# EAGLE design powerboard (EAGLE 7.7.0)
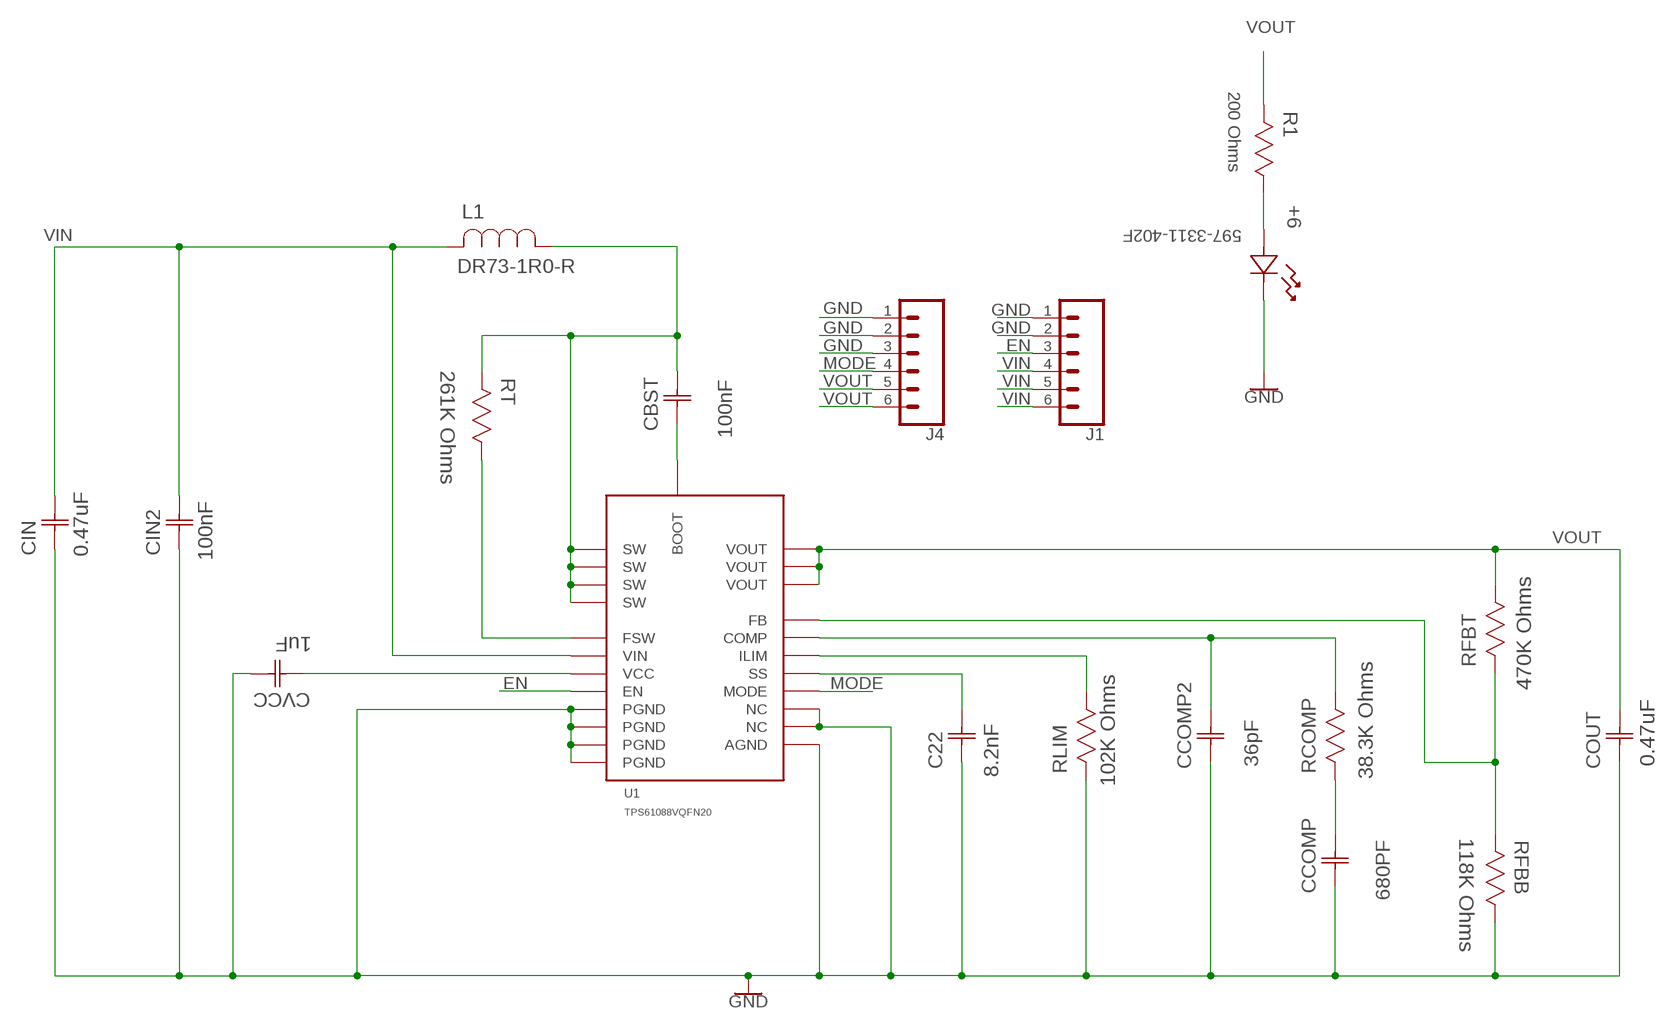
[diagram p0: schematic, sheet 1]

## Parts
+6  597-3311-402F  [LED_597-3311-402F]
C22  8.2nF  C0402C822K5RACTU  [CAPC1005X60N]
CBST  100nF  08053C104KAT2A  [CAPC2013X94N]
CCOMP  680PF  0603YC681JAT2A  [CAPC1608X90N]
CCOMP2  36pF  C0402C360J5GACTU  [CAPC1005X60N]
CIN  0.47uF  C1206F474K5RACAUTO  [CAPC3216X180N]
CIN2  100nF  GRM155R71C104KA88D  [CAPC1005X60N]
COUT  0.47uF  C1206F474K5RACAUTO  [CAPC3216X180N]
CVCC  1uF  GRM188R60J105KA01D  [CAPC1608X85N]
J1  CONN_06LONGPADS  [1X06_LONGPADS]
J4  CONN_06LONGPADS  [1X06_LONGPADS]
L1  DR73-1R0-R  [INDM7676X355N]
R1  200 Ohms  CRCW1206200RJNEA  [RESC3216X71N]
RCOMP  38.3K Ohms  CRCW040238K3FKED  [RESC1005X40N]
RFBB  118K Ohms  CRCW0402118KFKED  [RESC1005X40N]
RFBT  470K Ohms  RC0603FR-07470KL  [RESC1608X60N]
RLIM  102K Ohms  CRCW0402102KFKED  [RESC1005X40N]
RT  261K Ohms  CRCW0402261KFKED  [RESC1005X40N]
U1  TPS61088VQFN20  [VQFN20]

## Nets
BOOT: CBST.1(C1) U1.P$8(BOOT)
COMP: CCOMP2.2(C2) RCOMP.1 U1.P$18(COMP)
EN: J1.3 U1.P$2(EN)
FB: RFBB.2 RFBT.2(R2) U1.P$17(FB)
FSW: RT.1 U1.P$3(FSW)
GND: +6.1 C22.1(C1) CCOMP2.1(C1) CCOMP.1(C1) CIN2.1(C1) CIN.1(C1) COUT.1(C1) CVCC.2(C2) J1.1(>NAME) J1.2 J4.1(>NAME) J4.2 J4.3 RFBB.1 RLIM.2 U1.P$11(NC) U1.P$12(NC) U1.P$20(AGND) U1.P$21(PGND) U1.P$22(PGND) U1.P$23(PGND) U1.P$24(PGND)
ILIM: RLIM.1 U1.P$19(ILIM)
LED_ANODE: +6.2 R1.1
MODE: J4.4 U1.P$13(MODE)
N$1: CCOMP.2(C2) RCOMP.2
SS: C22.2(C2) U1.P$10(SS)
SW: CBST.2(C2) L1.1 RT.2 U1.P$4(SW) U1.P$5(SW) U1.P$6(SW) U1.P$7(SW)
VCC: CVCC.1(C1) U1.P$1(VCC)
VIN: CIN2.2(C2) CIN.2(C2) J1.4 J1.5 J1.6 L1.2 U1.P$9(VIN)
VOUT: COUT.2(C2) J4.5 J4.6 R1.2 RFBT.1(R1) U1.P$14(VOUT) U1.P$15(VOUT) U1.P$16(VOUT)

## Library data of the parts
+6 = Dialight_By_element14_Batch_1:597-3311-402F: LED 1206 Green SMT; COLOR: Green; MPN: 597-3311-402F; OC_FARNELL: 1179613; OC_NEWARK: 30K4956; PACKAGE: 1206- Green LED; SUPPLIER: Dialight
C22 = Kemet_By_element14_Batch_1:C0402C822K5RACTU: CAPACITOR, 0402; MPN: C0402C822K5RACTU; OC_FARNELL: 1865460; OC_NEWARK: 29T8966; SUPPLIER: KEMET; TOLERANCE: ±10%; VOLTAGERATING: 50V
CBST = AVX_By_element14_Batch_1:08053C104KAT2A: Capacitor 0805; MPN: 08053C104KAT2A; OC_FARNELL: 1740665; OC_NEWARK: 96M1381; SUPPLIER: AVX; TOLERANCE: ±10%; VOLTAGERATING: 25V
CCOMP = AVX_By_element14_Batch_1:0603YC681JAT2A: Capacitor, 0603; MPN: 0603YC681JAT2A; OC_FARNELL: -; OC_NEWARK: 55J2711; SUPPLIER: AVX; TOLERANCE: ±5%; VOLTAGERATING: 16V
CCOMP2 = Kemet_By_element14_Batch_1:C0402C360J5GACTU: CAPACITOR, 0402; MPN: C0402C360J5GACTU; OC_FARNELL: 1865427; OC_NEWARK: 29T8949; SUPPLIER: KEMET; TOLERANCE: ±5%; VOLTAGERATING: 50V
CIN COUT = Kemet_By_element14_Batch_1:C1206F474K5RACAUTO: CAPACITOR, 1206; MPN: C1206F474K5RACAUTO; OC_FARNELL: 1869060; OC_NEWARK: 32T6755; SUPPLIER: KEMET; TOLERANCE: ±10%; VOLTAGERATING: 50V
CIN2 = Murata_By_element14_Batch_1:GRM155R71C104KA88D: CAPACITOR, 0402; MPN: GRM155R71C104KA88D; OC_FARNELL: 8819742; OC_NEWARK: 38K1647; SUPPLIER: Murata; TOLERANCE: ±10%; VOLTAGERATING: 16V
CVCC = Murata_By_element14_Batch_1:GRM188R60J105KA01D: CAPACITOR, 0603; MPN: GRM188R60J105KA01D; OC_FARNELL: 9527699; OC_NEWARK: 97K0609; SUPPLIER: Murata; TOLERANCE: ±10%; VOLTAGERATING: 6.3V
J1 J4 = SparkFun-Connectors:CONN_06: Multi connection point. Often used as Generic Header-pin footprint for 0.1 inch spaced/style header connections On any of the 0.1 inch spaced packages, you can populate with these: Break Away Headers - Straight <https://www.sparkfun.com/products/116> (PRT-00116) Break Away Male Headers - Right Angle <https://www.sparkfun.com/products/553> (PRT-00553) Female Headers <https://www.sparkfun.com/products/115> (PRT-00115) Break Away Headers - Machine Pin <https://www.sparkfun.com/products/117> (PRT-00117) Break Away Female Headers - Swiss Machine Pin <https://www.sparkfun.com/products/743> (PRT-00743) Arduino Stackable Header - 6 Pin <https://www.sparkfun.com/products/9280> (PRT-09280) For SCREWTERMINALS and SPRING TERMINALS visit here: Screw Terimnals on SparkFun.com <https://www.sparkfun.com/search/results?term=Screw+Terminals> (5mm/3.5mm/2.54mm spacing) This device is also useful as a general connection point to wire up your design to another part of your project. Our various solder wires solder well into these plated through hole pads. Hook-Up Wire - Assortment (Stranded, 22 AWG) <https://www.sparkfun.com/products/11375> (PRT-11375) Hook-Up Wire - Assortment (Solid Core, 22 AWG) <https://www.sparkfun.com/products/11367> (PRT-11367) View the entire wire category on our website here <https://www.sparkfun.com/categories/141>
L1 = Coiltronics_By_element14_Batch_1:DR73-1R0-R: POWER INDUCTOR; CURRENTRATING: 5.28A; INDUCTANCE: 1µH; MPN: DR73-1R0-R; OC_FARNELL: 1463503; OC_NEWARK: 29K6167; PACKAGE: SMD; SUPPLIER: COILTRONICS; TOLERANCE: ±20%
R1 = Vishay_By_element14_Batch_1:CRCW1206200RJNEA: RESISTOR, 1206; MPN: CRCW1206200RJNEA; OC_FARNELL: 1540005; OC_NEWARK: 59M6966; SUPPLIER: Vishay; TOLERANCE: ±5%; WATTAGE: 0.25W
RCOMP = Vishay_By_element14_Batch_1:CRCW040238K3FKED: RESISTOR, 0402; MPN: CRCW040238K3FKED; OC_FARNELL: 1151219; OC_NEWARK: 52K7021; SUPPLIER: VISHAY DALE ELECTRONICS; TOLERANCE: ±1%; WATTAGE: 0.063 W
RFBB = Vishay_By_element14_Batch_1:CRCW0402118KFKED: RESISTOR, 0402; MPN: CRCW0402118KFKED; OC_FARNELL: 1652743; OC_NEWARK: 52K6643; SUPPLIER: Vishay; TOLERANCE: ±1%; WATTAGE: 0.063W
RFBT = Yageo_By_element14_Batch_1:RC0603FR-07470KL: RESISTOR, 0603; MPN: RC0603FR-07470KL; OC_FARNELL: 1117267; OC_NEWARK: 68R0098; SUPPLIER: Yageo; TOLERANCE: ±1%; WATTAGE: 1/10 W
RLIM = Vishay_By_element14_Batch_1:CRCW0402102KFKED: RESISTOR, 0402; MPN: CRCW0402102KFKED; OC_FARNELL: 1150767; OC_NEWARK: 52K6611; SUPPLIER: VISHAY DALE ELECTRONICS; TOLERANCE: ±1%; WATTAGE: 0.063 W
RT = Vishay_By_element14_Batch_1:CRCW0402261KFKED: RESISTOR, 0402; MPN: CRCW0402261KFKED; OC_FARNELL: 1151087; OC_NEWARK: 52K6902; SUPPLIER: VISHAY DALE ELECTRONICS; TOLERANCE: ±1%; WATTAGE: 0.063 W
U1 = digikey:TPS61088: TPS61088 10-A Fully-Integrated Synchronous Boost Converter Input Voltage Range: 2.7 to 12 V Output Voltage Range: 4.5 to 12.6 V 10-A Switch Current Up to 91% Efficiency at VIN = 3.3 V, VOUT = 9 V, and IOUT = 3 A Mode Selection Between PFM Mode and ForcedPWM Mode at Light Load 1.0 μA Current into VIN Pin during Shutdown Resistor-Programmable Switch Peak Current Limit Adjustable Switching Frequency: 200 kHz to 2.2MHz Programmable Soft Start Output Overvoltage Protection at 13.2 V Cycle-by-Cycle Overcurrent Protection Thermal Shutdown 4.50-mm × 3.50-mm 20-Pin VQFN Package Description The TPS61088 is a high power density, fully integrated synchronous boost converter with a 11-mΩ power switch and a 13-mΩ rectifier switch to provide a high efficiency and small size solution in portable systems. The TPS61088 has wide input voltage range from 2.7 V to 12 V to support applications with single cell or two cell Lithium batteries. The device has 10-A switch current capability and is capable of providing an output voltage up to 12.6 V. The TPS61088 uses adaptive constant off-time peak current control topology to regulate the output voltage. In moderate to heavy load condition, the TPS61088 works in the pulse width modulation (PWM) mode. In light load condition, the device has two operation modes selected by the MODE pin. One is the pulse frequency modulation (PFM) mode to improve the efficiency and another one is the forced PWM mode to avoid application problems caused by low switching frequency. The switching frequency in the PWM mode is adjustable ranging from 200 kHz to 2.2 MHz by an external resistor. The TPS61088 also implements a programmable soft-start function and an adjustable switching peak current limit function. In addition, the device provides 13.2-V output overvoltage protection, cycle-by-cycle overcurrent protection, and thermal shutdown protection. The TPS61088 is available in a 4.50-mm × 3.50-mm 20-pin VQFN package.; TYPE: boost

## Board
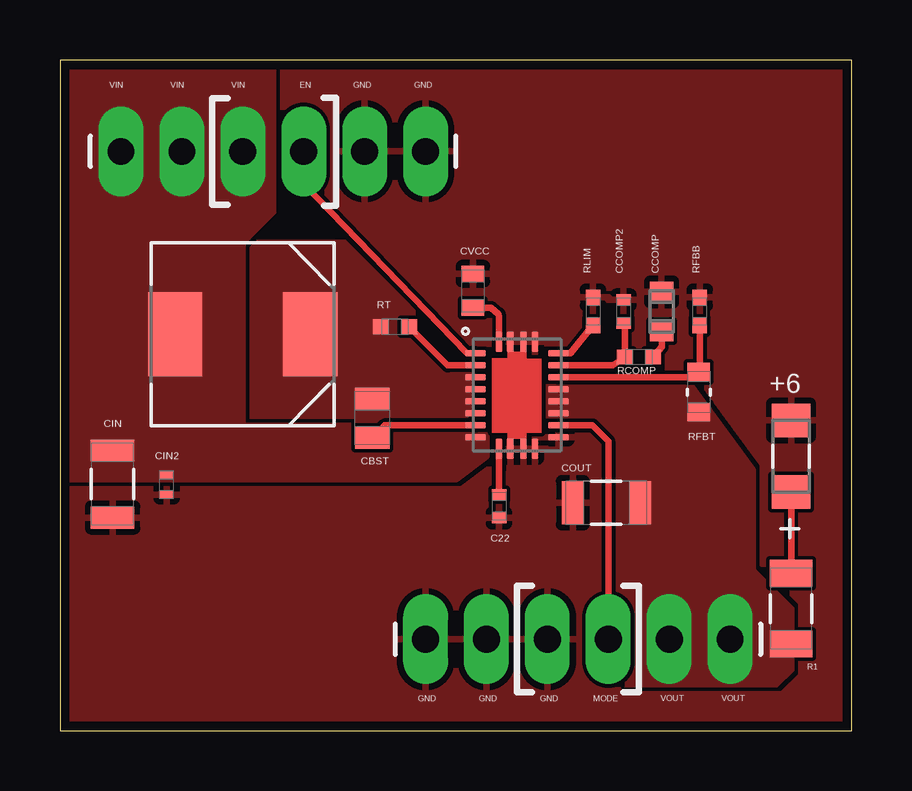
[diagram p1: board, top side]

Size 33.02 x 27.94 mm. Coordinates in mm from the lower left corner, seen from the top.
Outline: 0,0 33.02,0 33.02,27.94 0,27.94 0,0
Copper layers (1*16): Top 0.0356mm / dielectric 1.5011mm / Bottom 0.0356mm
Design rules "default *": minimum track width 6mil, minimum drill 13mil, track to track 6mil, track to pad 6mil, pad to pad 6mil, via to via 6mil, smd to smd 6mil, copper to edge 15mil, drill to drill 6mil, minimum pad ring 7mil, minimum via ring 7mil, stop-mask expansion 2.5mil, vias tented up to drill 0mil, thermal gap 10mil

### Footprints (pad centres in the part's own frame; a part is rotated, then mirrored left to right if it is on the bottom)
LED_597-3311-402F = smd 1.397 x 1.6: 1 -1.499,0; 2 1.499,0
CAPC1005X60N = smd 0.457 x 0.61: 1 -0.483,0; 2 0.483,0
CAPC2013X94N = smd 0.914 x 1.448: 1 -0.813,0; 2 0.813,0
CAPC1608X90N = smd 0.864 x 0.965: 1 -0.813,0; 2 0.813,0
CAPC3216X180N = smd 0.914 x 1.803: 1 -1.397,0; 2 1.397,0
CAPC1005X60N' = smd 0.305 x 0.61: 1 -0.406,0; 2 0.406,0
CAPC1608X85N = smd 0.66 x 0.94: 1 -0.711,0; 2 0.711,0
1X06_LONGPADS = drill 1.118 pad 1.88 long: 1 0,0; 2 2.54,0; 3 5.08,0; 4 7.62,0; 5 10.16,0; 6 12.7,0
INDM7676X355N = smd 2.261 x 3.505: 1 -2.819,0; 2 2.819,0
RESC3216X71N = smd 1.118 x 1.753: 1 -1.473,0; 2 1.473,0
RESC1005X40N = smd 0.66 x 0.61: 1 -0.584,0; 2 0.584,0
RESC1608X60N = smd 0.762 x 0.94: 1 -0.838,0; 2 0.838,0
VQFN20 = smd 0.85 x 0.28: P$1 -2.225,-0.75; P$10 2.225,-0.75; P$11 2.225,0.75; P$20 -2.225,0.75; P$21 -2.225,0.275; P$22 -2.225,-0.275; P$23 2.225,-0.275; P$24 2.225,0.275 | smd 0.28 x 0.85: P$2 -1.75,-1.725; P$3 -1.25,-1.725; P$4 -0.75,-1.725; P$5 -0.25,-1.725; P$6 0.25,-1.725; P$7 0.75,-1.725; P$8 1.25,-1.725; P$9 1.75,-1.725; P$12 1.75,1.725; P$13 1.25,1.725; P$14 0.75,1.725; P$15 0.25,1.725; P$16 -0.25,1.725; P$17 -0.75,1.725; P$18 -1.25,1.725; P$19 -1.75,1.725

### Placement (x,y rotation side)
+6  30.48,11.43 270 top
C22  18.31,9.34 90 top
CBST  13.02,13.02 90 top
CCOMP  25.08,17.46 270 top
CCOMP2  23.5,17.46 270 top
CIN  2.19,10.27 90 top
CIN2  100nF  [CAPC1005X60N']  4.45,10.24 90 top
COUT  22.77,9.49 0 top
CVCC  17.22,18.32 90 top
J1  15.24,24.13 180 top
J4  15.24,3.81 0 top
L1  7.62,16.51 180 top
R1  30.48,5.08 270 top
RCOMP  24.13,15.56 0 top
RFBB  26.67,17.46 270 top
RFBT  26.63,14.1 90 top
RLIM  22.23,17.46 90 top
RT  13.97,16.83 180 top
U1  19.05,13.97 270 top

### Tracks (layer width: path | path; a pad name or v marks a point on that pad's centre or on a via)
BOOT
  Top 0.27: U1.P$8 13.53,12.72 CBST.1
COMP
  Top 0.27: U1.P$18 23.05,15.22 RCOMP.1 23.55,16.93 CCOMP2.2
EN
  Top 0.27: J1.3 10.16,22.79 16.97,15.72 U1.P$2
FB
  Top 0.27: U1.P$17 26.41,14.72 RFBT.2 26.67,14.98 RFBB.2
FSW
  Top 0.27: 17.34,15.22 U1.P$3 16.16,15.22 RT.1
GND
  pour Top (rank 3): 0,27.94 0,0 33.02,0 33.02,27.94
  pour Top (no thermals): 18.73,16.19 20.32,16.19 20.32,17.78 18.73,17.78
ILIM
  Top 0.27: U1.P$19 21.28,15.72 RLIM.1
LED_ANODE
  Top 0.27: R1.1 +6.2
MODE
  Top 0.27: U1.P$13 22.2,12.72 22.86,12.06 J4.4
N$1
  Top 0.27: RCOMP.2 25.08,15.99 CCOMP.2
SS
  Top 0.27: C22.2 18.31,10.91 U1.P$10
SW
  pour Top (rank 2, no thermals): 7.62,20.32 11.86,20.32 14.67,17.51 17.08,14.99 17.14,13.34 15.56,11.75 13.97,11.75 13.97,12.51 13.89,12.51 7.68,12.52
VCC
  Top 0.27: CVCC.1 17.97,17.61 18.29,17.36 18.31,17.27 U1.P$1
VIN
  pour Top (no thermals): 0,27.94 8.89,27.94 8.89,21.59 7.62,20.32 7.62,12.7 17.78,12.7 17.78,11.43 16.51,10.48 0,10.48 0.02,26.65
VOUT
  pour Top (no thermals): 20.39,14.54 20.38,14.54 20.38,12.53 22.27,12.53 23.03,11.77 23.03,1.93 29.86,1.93 30.48,2.54 30.48,5.08 28.89,6.67 28.89,10.84 26.15,14.55 20.38,14.55

### Text on the board
tNames: VIN | VIN | VIN | EN | GND | GND | GND | GND | GND | MODE | VOUT | VOUT